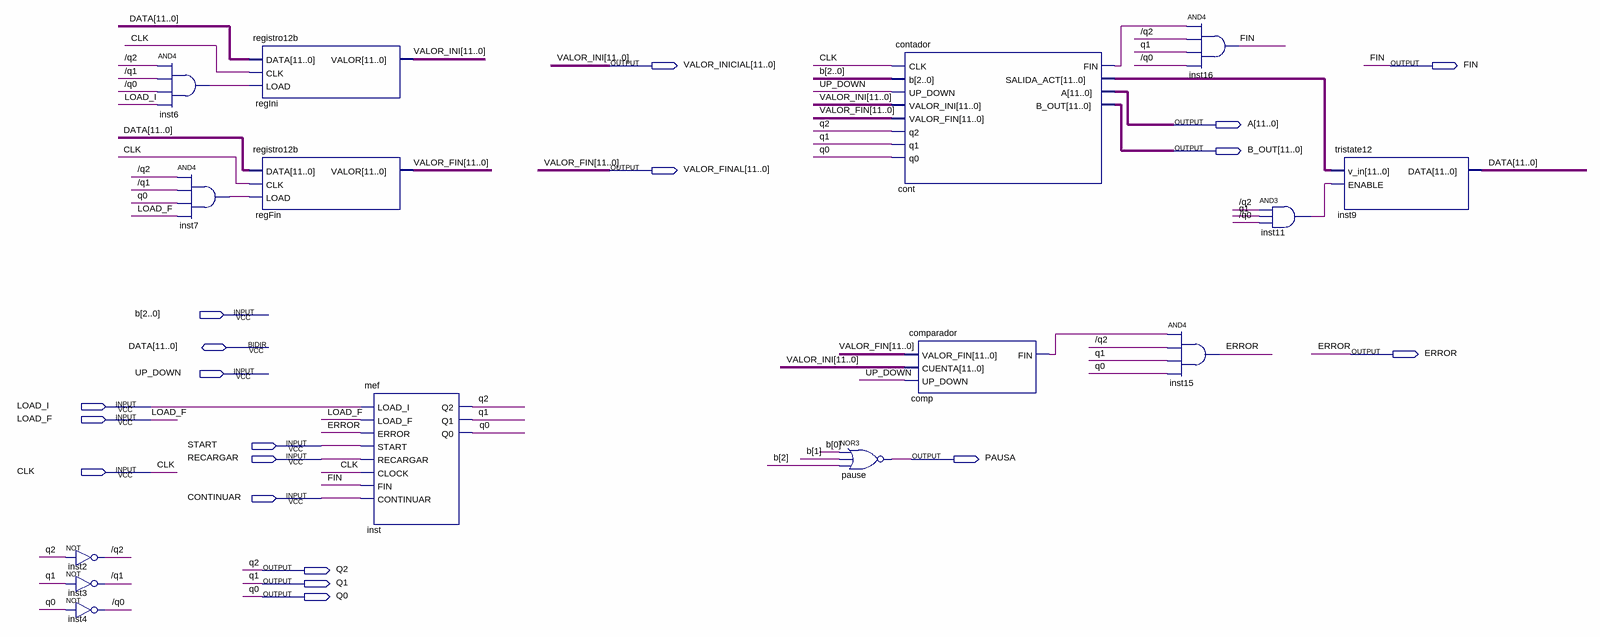
[diagram p0: schematic sheet]
// Quartus schematic integrador.bdf as structural Verilog: 15 symbols, 19 pins
module integrador (
  input  [2:0] b,
  input  UP_DOWN,
  input  LOAD_I,
  input  LOAD_F,
  input  START,
  input  RECARGAR,
  input  CLK,
  input  CONTINUAR,
  inout  [11:0] DATA,
  output [11:0] VALOR_INICIAL,
  output FIN,
  output [11:0] A,
  output [11:0] B_OUT,
  output [11:0] VALOR_FINAL,
  output ERROR,
  output PAUSA,
  output Q2,
  output Q1,
  output Q0
);

  wire \/q0 , \/q1 , \/q2 , comp_fin, cont_fin, inst6_out, inst7_out, inst11_out;
  wire [11:0] cont_salida_act;

  not inst2 (\/q2 , Q2);
  not inst3 (\/q1 , Q1);
  not inst4 (\/q0 , Q0);
  and inst6 (inst6_out, \/q2 , \/q1 , \/q0 , LOAD_I);
  and inst7 (inst7_out, \/q2 , \/q1 , Q0, LOAD_F);
  registro12b regIni (.DATA(DATA), .CLK(CLK), .LOAD(inst6_out), .VALOR(VALOR_INICIAL));
  registro12b regFin (.DATA(DATA), .CLK(CLK), .LOAD(inst7_out), .VALOR(VALOR_FINAL));
  mef inst (
    .LOAD_I(LOAD_I), .LOAD_F(LOAD_F), .ERROR(ERROR), .START(START), .RECARGAR(RECARGAR), .CLOCK(CLK),
    .FIN(FIN), .CONTINUAR(CONTINUAR), .Q2(Q2), .Q1(Q1), .Q0(Q0));
  nor pause (PAUSA, b[0], b[1], b[2]);
  contador cont (
    .CLK(CLK), .b(b), .UP_DOWN(UP_DOWN), .VALOR_INI(VALOR_INICIAL), .VALOR_FIN(VALOR_FINAL), .q2(Q2),
    .q1(Q1), .q0(Q0), .FIN(cont_fin), .SALIDA_ACT(cont_salida_act), .A(A), .B_OUT(B_OUT));
  comparador comp (.VALOR_FIN(VALOR_FINAL), .CUENTA(VALOR_INICIAL), .UP_DOWN(UP_DOWN), .FIN(comp_fin));
  and inst16 (FIN, cont_fin, \/q2 , Q1, \/q0 );
  and inst15 (ERROR, comp_fin, \/q2 , Q1, Q0);
  and inst11 (inst11_out, \/q2 , Q1, \/q0 );
  tristate12 inst9 (.v_in(cont_salida_act), .ENABLE(inst11_out), .DATA(DATA));

  // Other names for the same wires on the sheet: VALOR_FIN[11:0] = VALOR_FINAL; VALOR_INI[11:0] = VALOR_INICIAL
endmodule
